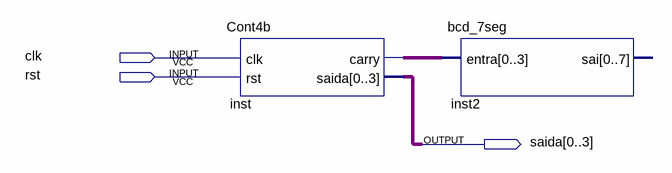
[diagram p0: schematic sheet]
// Quartus schematic Bloco.bdf as structural Verilog: 2 symbols, 3 pins
module Bloco (
  input  clk,
  input  rst,
  output [0:3] saida
);

  wire [3:0] inst_carry;

  Cont4b inst (.clk(clk), .rst(rst), .carry(inst_carry), .saida(saida));
  bcd_7seg inst2 (.entra(inst_carry));  // open: sai
endmodule
